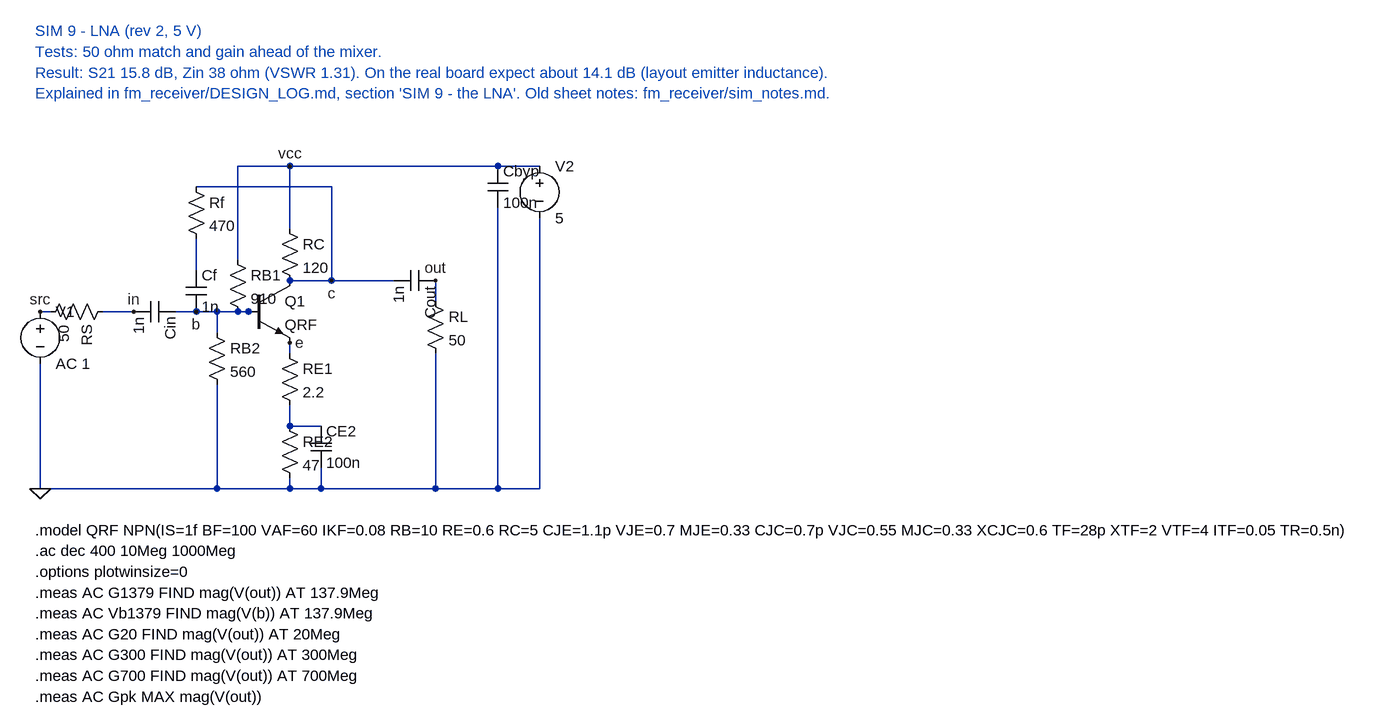
[diagram p0: schematic sim9_lna.asc]
sim9_lna.asc, the LTspice schematic file:
Version 4
SHEET 1 1200 900
WIRE 80 240 96 240
WIRE 176 240 224 240
WIRE 288 240 320 240
WIRE 320 240 352 240
WIRE 352 240 384 240
WIRE 384 240 416 240
WIRE 320 128 320 176
WIRE 320 48 528 48
WIRE 352 240 352 272
WIRE 352 352 352 512
WIRE 384 16 384 160
WIRE 464 112 464 16
WIRE 464 192 528 192
WIRE 528 48 528 192
WIRE 528 192 624 192
WIRE 688 192 688 224
WIRE 688 304 688 512
WIRE 464 288 464 304
WIRE 464 384 464 416
WIRE 464 416 512 416
WIRE 512 480 512 512
WIRE 464 496 464 512
WIRE 384 16 464 16
WIRE 464 16 784 16
WIRE 784 16 848 16
WIRE 784 80 784 512
WIRE 848 96 848 512
WIRE 80 320 80 512
WIRE 80 512 352 512
WIRE 352 512 464 512
WIRE 464 512 512 512
WIRE 512 512 688 512
WIRE 688 512 784 512
WIRE 784 512 848 512
FLAG 80 512 0
FLAG 464 16 vcc
FLAG 80 240 src
FLAG 224 240 in
FLAG 320 240 b
FLAG 528 192 c
FLAG 688 192 out
FLAG 464 288 e
SYMBOL voltage 80 224 R0
SYMATTR InstName V1
SYMATTR Value AC 1
SYMBOL res 192 224 R90
SYMATTR InstName RS
SYMATTR Value 50
SYMBOL cap 288 224 R90
SYMATTR InstName Cin
SYMATTR Value 1n
SYMBOL res 304 32 R0
SYMATTR InstName Rf
SYMATTR Value 470
SYMBOL cap 304 176 R0
SYMATTR InstName Cf
SYMATTR Value 1n
SYMBOL res 368 144 R0
SYMATTR InstName RB1
SYMATTR Value 910
SYMBOL res 336 256 R0
SYMATTR InstName RB2
SYMATTR Value 560
SYMBOL npn 400 192 R0
SYMATTR InstName Q1
SYMATTR Value QRF
SYMBOL res 448 96 R0
SYMATTR InstName RC
SYMATTR Value 120
SYMBOL res 448 288 R0
SYMATTR InstName RE1
SYMATTR Value 2.2
SYMBOL res 448 400 R0
SYMATTR InstName RE2
SYMATTR Value 47
SYMBOL cap 496 416 R0
SYMATTR InstName CE2
SYMATTR Value 100n
SYMBOL cap 688 176 R90
SYMATTR InstName Cout
SYMATTR Value 1n
SYMBOL res 672 208 R0
SYMATTR InstName RL
SYMATTR Value 50
SYMBOL cap 768 16 R0
SYMATTR InstName Cbyp
SYMATTR Value 100n
SYMBOL voltage 848 0 R0
SYMATTR InstName V2
SYMATTR Value 5
TEXT 72 576 Left 2 !.model QRF NPN(IS=1f BF=100 VAF=60 IKF=0.08 RB=10 RE=0.6 RC=5 CJE=1.1p VJE=0.7 MJE=0.33 CJC=0.7p VJC=0.55 MJC=0.33 XCJC=0.6 TF=28p XTF=2 VTF=4 ITF=0.05 TR=0.5n)
TEXT 72 608 Left 2 !.ac dec 400 10Meg 1000Meg
TEXT 72 640 Left 2 !.options plotwinsize=0
TEXT 72 672 Left 2 !.meas AC G1379 FIND mag(V(out)) AT 137.9Meg
TEXT 72 704 Left 2 !.meas AC Vb1379 FIND mag(V(b)) AT 137.9Meg
TEXT 72 736 Left 2 !.meas AC G20 FIND mag(V(out)) AT 20Meg
TEXT 72 768 Left 2 !.meas AC G300 FIND mag(V(out)) AT 300Meg
TEXT 72 800 Left 2 !.meas AC G700 FIND mag(V(out)) AT 700Meg
TEXT 72 832 Left 2 !.meas AC Gpk MAX mag(V(out))
TEXT 72 -192 Left 2 ;SIM 9 - LNA (rev 2, 5 V)
TEXT 72 -160 Left 2 ;Tests: 50 ohm match and gain ahead of the mixer.
TEXT 72 -128 Left 2 ;Result: S21 15.8 dB, Zin 38 ohm (VSWR 1.31). On the real board expect about 14.1 dB (layout emitter inductance).
TEXT 72 -96 Left 2 ;Explained in fm_receiver/DESIGN_LOG.md, section 'SIM 9 - the LNA'. Old sheet notes: fm_receiver/sim_notes.md.

The netlist it stands for:
* sim9_lna.asc
V1 src 0 AC 1
RS in src 50
Cin b in 1n
Rf c N001 470
Cf N001 b 1n
RB1 vcc b 910
RB2 b 0 560
Q1 c b e 0 QRF
RC vcc c 120
RE1 e N002 2.2
RE2 N002 0 47
CE2 N002 0 100n
Cout out c 1n
RL out 0 50
Cbyp vcc 0 100n
V2 vcc 0 5
.model NPN NPN
.model PNP PNP
.lib standard.bjt
.model QRF NPN(IS=1f BF=100 VAF=60 IKF=0.08 RB=10 RE=0.6 RC=5 CJE=1.1p VJE=0.7 MJE=0.33 CJC=0.7p VJC=0.55 MJC=0.33 XCJC=0.6 TF=28p XTF=2 VTF=4 ITF=0.05 TR=0.5n)
.ac dec 400 10Meg 1000Meg
.options plotwinsize=0
.meas AC G1379 FIND mag(V(out)) AT 137.9Meg
.meas AC Vb1379 FIND mag(V(b)) AT 137.9Meg
.meas AC G20 FIND mag(V(out)) AT 20Meg
.meas AC G300 FIND mag(V(out)) AT 300Meg
.meas AC G700 FIND mag(V(out)) AT 700Meg
.meas AC Gpk MAX mag(V(out))
* SIM 9 - LNA (rev 2, 5 V)
* Tests: 50 ohm match and gain ahead of the mixer.
* Result: S21 15.8 dB, Zin 38 ohm (VSWR 1.31). On the real board expect about 14.1 dB (layout emitter inductance).
* Explained in fm_receiver/DESIGN_LOG.md, section 'SIM 9 - the LNA'. Old sheet notes: fm_receiver/sim_notes.md.
.backanno
.end